# EAGLE design Relay_Board_V3 (EAGLE 8.4.0)

## Sheet 1 of 2
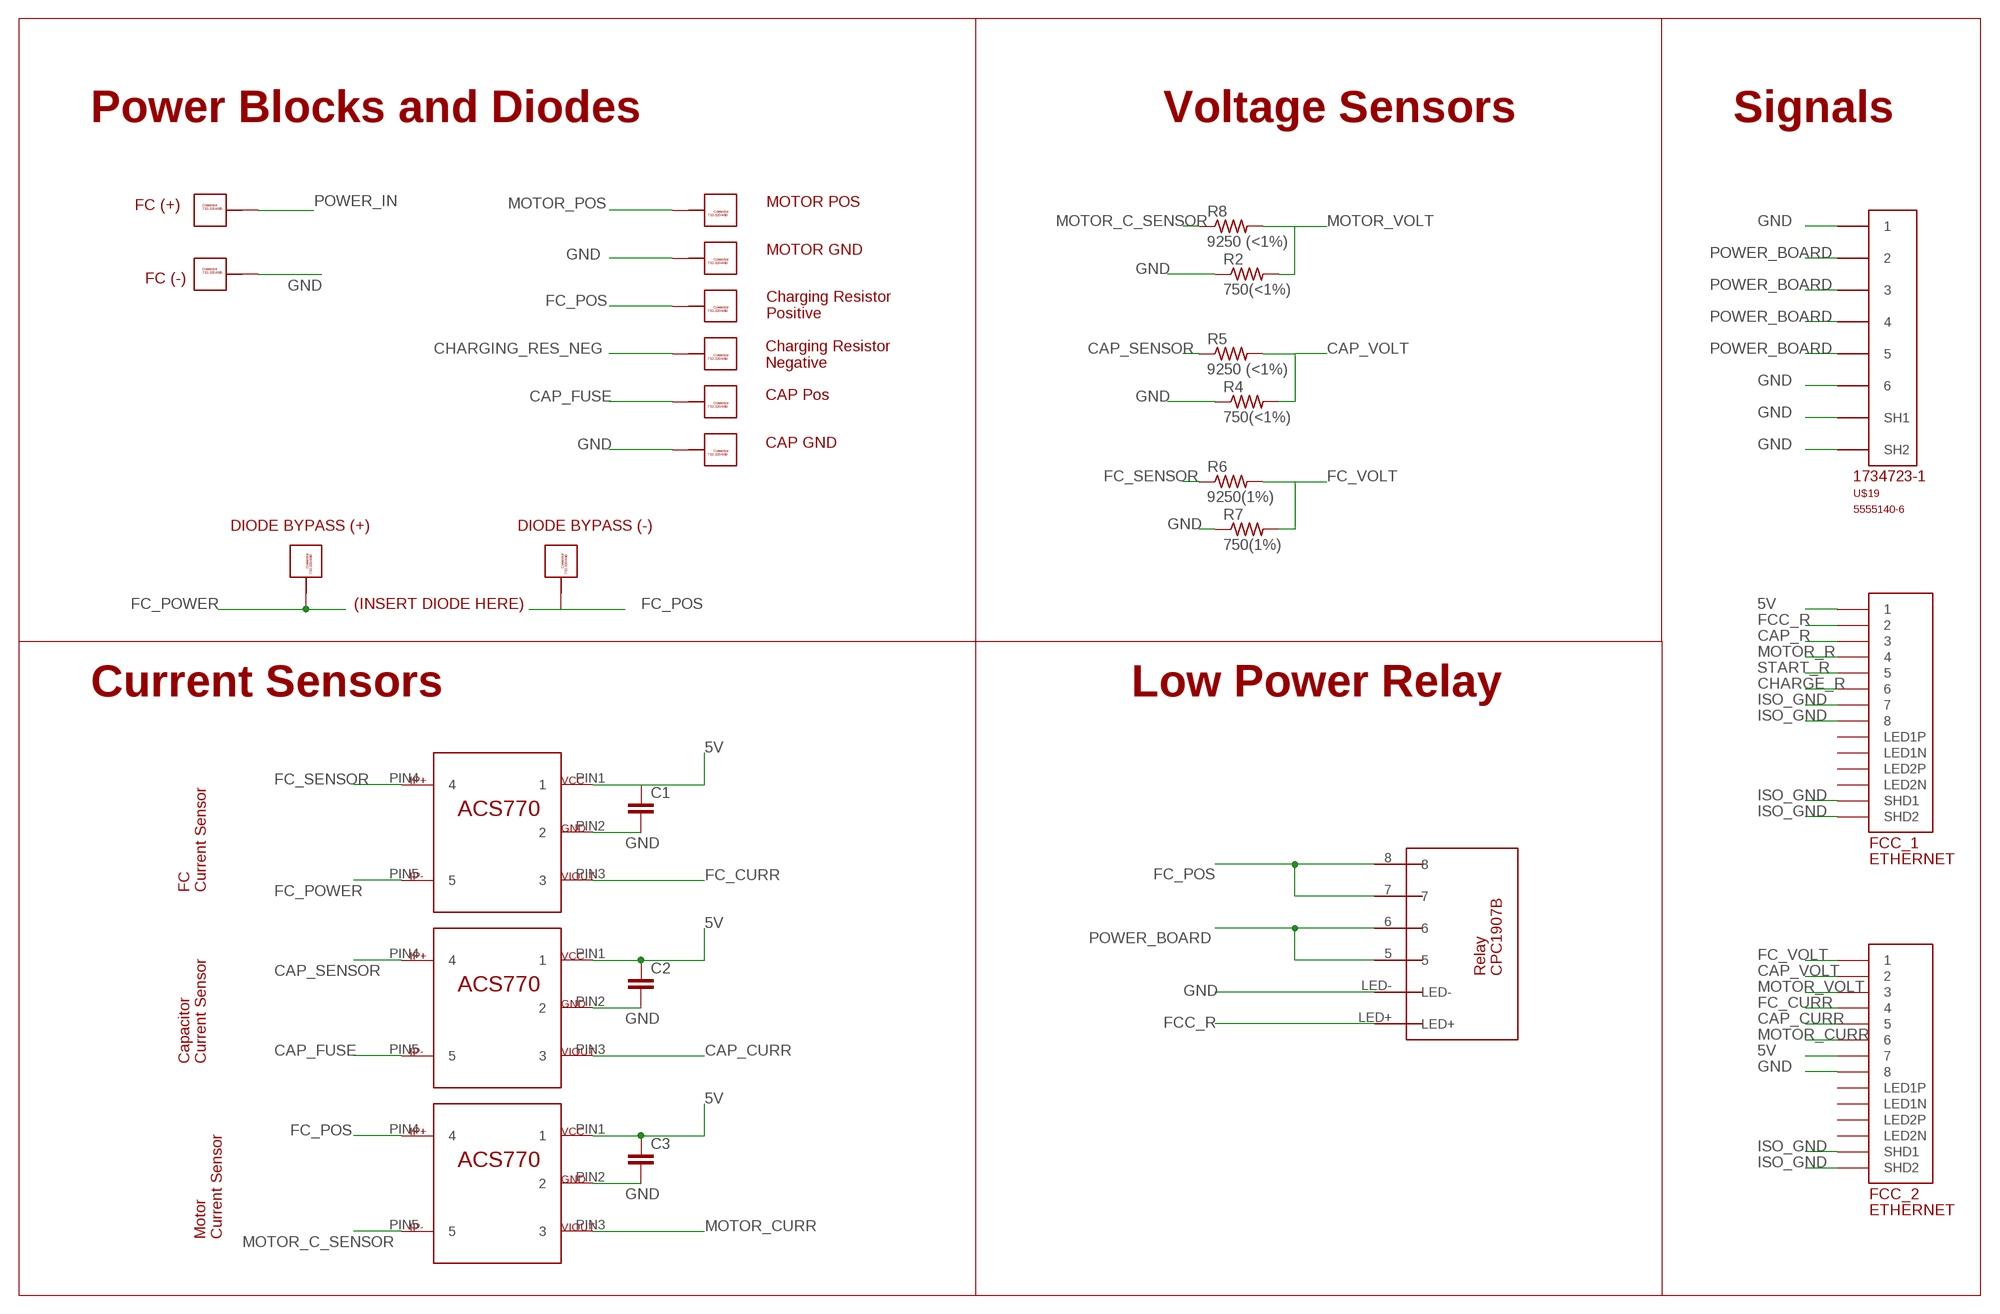
[diagram p0: schematic, sheet 1]

### Parts
C1  CAP0603-CAP  [0603-CAP]
C2  CAP0603-CAP  [0603-CAP]
C3  CAP0603-CAP  [0603-CAP]
CAP.GND  732-3204-ND_CONNECTOR  [732-3204-ND]
CAP.GND1  732-3204-ND_CONNECTOR  [732-3204-ND]
CAP.POS1  732-3204-ND_CONNECTOR  [732-3204-ND]
CAP.POS2  732-3204-ND_CONNECTOR  [732-3204-ND]
FC.GND  732-3204-ND_CONNECTOR  [732-3204-ND]
FC.POS  732-3204-ND_CONNECTOR  [732-3204-ND]
FCC_1  ETHERNET  [A122645-ND]
FCC_2  ETHERNET  [A122645-ND]
MOTOR.GROUND  732-3204-ND_CONNECTOR  [732-3204-ND]
MOTOR.POSITIVE  732-3204-ND_CONNECTOR  [732-3204-ND]
R2  750(<1%)  R-US_R0805  [R0805]
R4  750(<1%)  R-US_R0805  [R0805]
R5  9250 (<1%)  R-US_R0805  [R0805]
R6  9250(1%)  R-US_R0805  [R0805]
R7  750(1%)  R-US_R0805  [R0805]
R8  9250 (<1%)  R-US_R0805  [R0805]
RES.NEG  732-3204-ND_CONNECTOR  [732-3204-ND]
RES.POS  732-3204-ND_CONNECTOR  [732-3204-ND]
U$7  ACS770LCB_CURRENTSENSOR  [ACS770LCB_CURRENTSENSOR]
U$8  ACS770LCB_CURRENTSENSOR  [ACS770LCB_CURRENTSENSOR]
U$9  ACS770LCB_CURRENTSENSOR  [ACS770LCB_CURRENTSENSOR]
U$19  5555140-6  [1734723-1_RJ11]
U$22  RELAY-CPC1907B  [RELAY-CPC1907B]

### Nets
5V: C1.1 C2.1 C3.1 FCC_1.P$1 FCC_2.P$7 U$7.PIN1 U$8.PIN1 U$9.PIN1
CAP_CURR: FCC_2.P$5 U$8.PIN3
CAP_FUSE: CAP.GND1.P$1 CAP.GND1.P$2 CAP.GND1.P$3 CAP.GND1.P$4 CAP.GND1.P$5 CAP.GND1.P$6 CAP.GND1.P$7 CAP.GND1.P$8 CAP.GND1.P$9 CAP.GND1.P$10 U$8.PIN5 ; also sheet 2
CAP_R: FCC_1.P$3 ; also sheet 2
CAP_SENSOR: R5.1 U$8.PIN4
CAP_VOLT: FCC_2.P$2 R4.2 R5.2
CHARGE_R: FCC_1.P$6 ; also sheet 2
CHARGING_RES_NEG: RES.NEG.P$1 RES.NEG.P$2 RES.NEG.P$3 RES.NEG.P$4 RES.NEG.P$5 RES.NEG.P$6 RES.NEG.P$7 RES.NEG.P$8 RES.NEG.P$9 RES.NEG.P$10 ; also sheet 2
FC_CURR: FCC_2.P$4 U$7.PIN3
FC_POS: CAP.POS2.P$1 CAP.POS2.P$2 CAP.POS2.P$3 CAP.POS2.P$4 CAP.POS2.P$5 CAP.POS2.P$6 CAP.POS2.P$7 CAP.POS2.P$8 CAP.POS2.P$9 CAP.POS2.P$10 RES.POS.P$1 RES.POS.P$2 RES.POS.P$3 RES.POS.P$4 RES.POS.P$5 RES.POS.P$6 RES.POS.P$7 RES.POS.P$8 RES.POS.P$9 RES.POS.P$10 U$9.PIN4 U$22.7 U$22.8 ; also sheet 2
FC_POWER: CAP.POS1.P$1 CAP.POS1.P$2 CAP.POS1.P$3 CAP.POS1.P$4 CAP.POS1.P$5 CAP.POS1.P$6 CAP.POS1.P$7 CAP.POS1.P$8 CAP.POS1.P$9 CAP.POS1.P$10 U$7.PIN5
FC_SENSOR: R6.1 U$7.PIN4
FC_VOLT: FCC_2.P$1 R6.2 R7.2
FCC_R: FCC_1.P$2 U$22.LED+
GND: C1.2 C2.2 C3.2 CAP.GND.P$1 CAP.GND.P$2 CAP.GND.P$3 CAP.GND.P$4 CAP.GND.P$5 CAP.GND.P$6 CAP.GND.P$7 CAP.GND.P$8 CAP.GND.P$9 CAP.GND.P$10 FC.GND.P$1 FC.GND.P$2 FC.GND.P$3 FC.GND.P$4 FC.GND.P$5 FC.GND.P$6 FC.GND.P$7 FC.GND.P$8 FC.GND.P$9 FC.GND.P$10 FCC_2.P$8 MOTOR.GROUND.P$1 MOTOR.GROUND.P$2 MOTOR.GROUND.P$3 MOTOR.GROUND.P$4 MOTOR.GROUND.P$5 MOTOR.GROUND.P$6 MOTOR.GROUND.P$7 MOTOR.GROUND.P$8 MOTOR.GROUND.P$9 MOTOR.GROUND.P$10 R2.1 R4.1 R7.1 U$7.PIN2 U$8.PIN2 U$9.PIN2 U$19.1 U$19.6 U$19.SH1 U$19.SH2 U$22.LED- ; also sheet 2
ISO_GND: FCC_1.P$7 FCC_1.P$8 FCC_1.P$13(SHD1) FCC_1.P$14(SHD2) FCC_2.P$13(SHD1) FCC_2.P$14(SHD2) ; also sheet 2
MOTOR_C_SENSOR: R8.1 U$9.PIN5 ; also sheet 2
MOTOR_CURR: FCC_2.P$6 U$9.PIN3
MOTOR_POS: MOTOR.POSITIVE.P$1 MOTOR.POSITIVE.P$2 MOTOR.POSITIVE.P$3 MOTOR.POSITIVE.P$4 MOTOR.POSITIVE.P$5 MOTOR.POSITIVE.P$6 MOTOR.POSITIVE.P$7 MOTOR.POSITIVE.P$8 MOTOR.POSITIVE.P$9 MOTOR.POSITIVE.P$10 ; also sheet 2
MOTOR_R: FCC_1.P$4 ; also sheet 2
MOTOR_VOLT: FCC_2.P$3 R2.2 R8.2
POWER_BOARD: U$19.2 U$19.3 U$19.4 U$19.5 U$22.5 U$22.6
POWER_IN: FC.POS.P$1 FC.POS.P$2 FC.POS.P$3 FC.POS.P$4 FC.POS.P$5 FC.POS.P$6 FC.POS.P$7 FC.POS.P$8 FC.POS.P$9 FC.POS.P$10
START_R: FCC_1.P$5 ; also sheet 2
Unconnected: FCC_1.P$9(LED1N) FCC_1.P$10(LED1P) FCC_1.P$11(LED2N) FCC_1.P$12(LED2P) FCC_2.P$9(LED1N) FCC_2.P$10(LED1P) FCC_2.P$11(LED2N) FCC_2.P$12(LED2P)

### Notes on the sheet
- Power Blocks and Diodes | Voltage Sensors | Signals
- FC (+) | MOTOR POS
- MOTOR GND
- FC (-)
- Charging Resistor
  Positive
- Charging Resistor
  Negative
- CAP Pos
- CAP GND
- DIODE BYPASS (+) | DIODE BYPASS (-)
- (INSERT DIODE HERE)
- Current Sensors | Low Power Relay
- FC
  Current Sensor
- Capacitor
  Current Sensor
- Motor
  Current Sensor

## Sheet 2 of 2
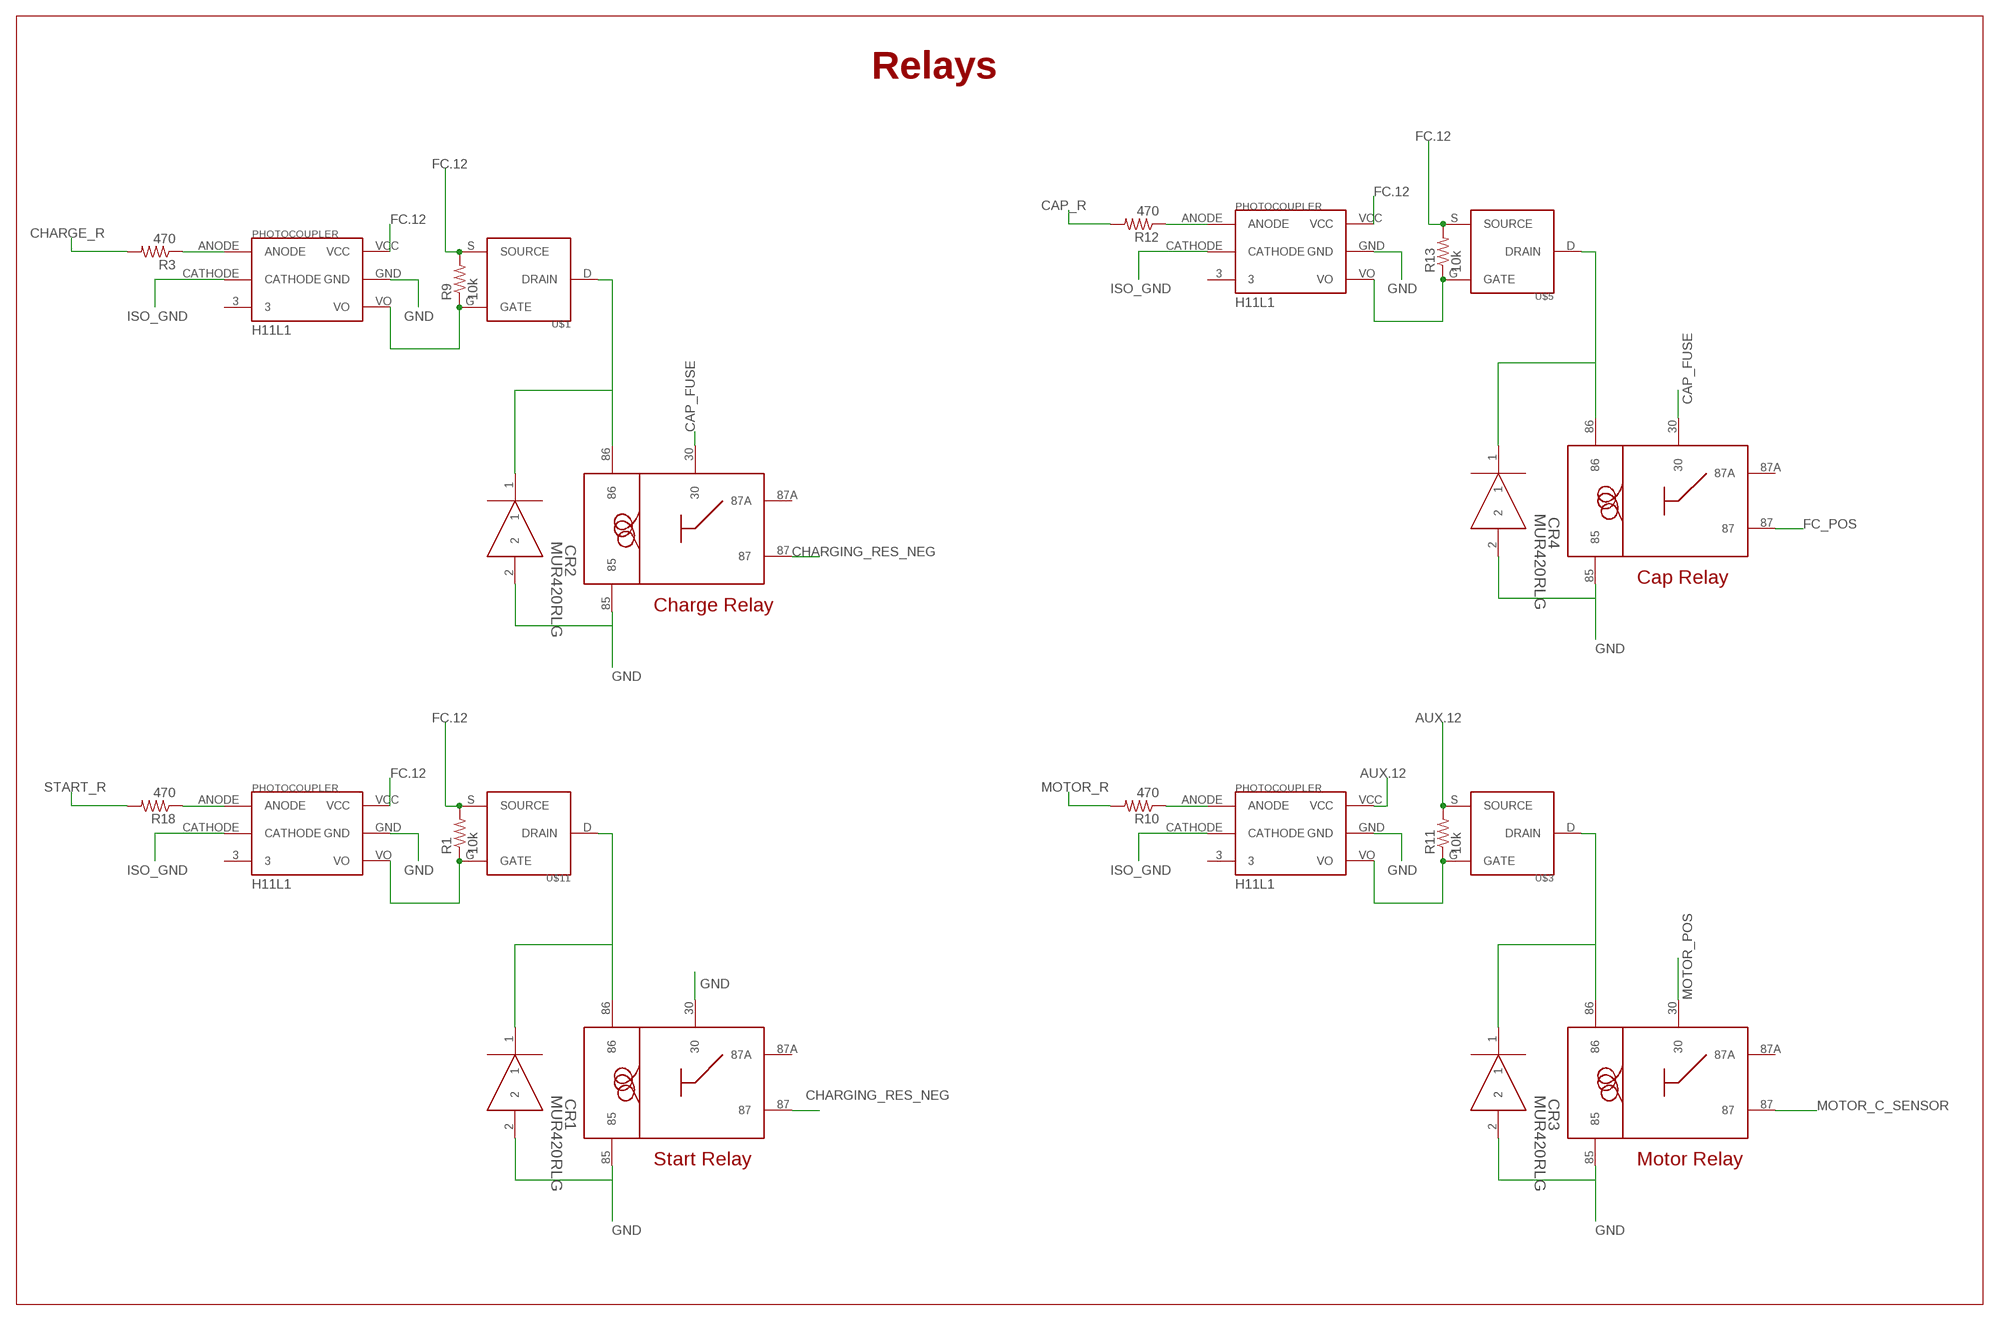
[diagram p1: schematic, sheet 2]

### Parts
CR1  MUR420RLG  [DO-201AD]
CR2  MUR420RLG  [DO-201AD]
CR3  MUR420RLG  [DO-201AD]
CR4  MUR420RLG  [DO-201AD]
R1  10k  RESISTOR0603-RES  [0603-RES]
R3  470  RESISTOR0603-RES  [0603-RES]
R9  10k  RESISTOR0603-RES  [0603-RES]
R10  470  RESISTOR0603-RES  [0603-RES]
R11  10k  RESISTOR0603-RES  [0603-RES]
R12  470  RESISTOR0603-RES  [0603-RES]
R13  10k  RESISTOR0603-RES  [0603-RES]
R18  470  RESISTOR0603-RES  [0603-RES]
START.RELAY1  VCF4-1000  [VCF4-1000]
START.RELAY2  VCF4-1000  [VCF4-1000]
START.RELAY3  VCF4-1000  [VCF4-1000]
START.RELAY4  VCF4-1000  [VCF4-1000]
U$1  DMP3056L-7DMP3056L-7  [DMP3056L-7]
U$2  H11L1H11L1  [H11L1]
U$3  DMP3056L-7DMP3056L-7  [DMP3056L-7]
U$4  H11L1H11L1  [H11L1]
U$5  DMP3056L-7DMP3056L-7  [DMP3056L-7]
U$6  H11L1H11L1  [H11L1]
U$11  DMP3056L-7DMP3056L-7  [DMP3056L-7]
U$12  H11L1H11L1  [H11L1]

### Nets
AUX.12: R11.2 U$3.S(SOURCE) U$4.VCC
CAP_FUSE: START.RELAY2.30 START.RELAY4.30 ; also sheet 1
CAP_R: R12.2 ; also sheet 1
CHARGE_R: R3.2 ; also sheet 1
CHARGING_RES_NEG: START.RELAY1.87 START.RELAY2.87 ; also sheet 1
FC.12: R1.2 R9.2 R13.2 U$1.S(SOURCE) U$2.VCC U$5.S(SOURCE) U$6.VCC U$11.S(SOURCE) U$12.VCC
FC_POS: START.RELAY4.87 ; also sheet 1
GND: CR1.2 CR2.2 CR3.2 CR4.2 START.RELAY1.30 START.RELAY1.85 START.RELAY2.85 START.RELAY3.85 START.RELAY4.85 U$2.GND U$4.GND U$6.GND U$12.GND ; also sheet 1
ISO_GND: U$2.CATHODE U$4.CATHODE U$6.CATHODE U$12.CATHODE ; also sheet 1
MOTOR_C_SENSOR: START.RELAY3.87 ; also sheet 1
MOTOR_POS: START.RELAY3.30 ; also sheet 1
MOTOR_R: R10.2 ; also sheet 1
N$1: R9.1 U$1.G(GATE) U$2.VO
N$2: R3.1 U$2.ANODE
N$3: CR2.1 START.RELAY2.86 U$1.D(DRAIN)
N$4: R11.1 U$3.G(GATE) U$4.VO
N$5: R10.1 U$4.ANODE
N$6: CR3.1 START.RELAY3.86 U$3.D(DRAIN)
N$7: R13.1 U$5.G(GATE) U$6.VO
N$8: R12.1 U$6.ANODE
N$13: CR4.1 START.RELAY4.86 U$5.D(DRAIN)
N$21: R1.1 U$11.G(GATE) U$12.VO
N$23: R18.1 U$12.ANODE
N$30: CR1.1 START.RELAY1.86 U$11.D(DRAIN)
START_R: R18.2 ; also sheet 1
Unconnected: START.RELAY1.87A START.RELAY2.87A START.RELAY3.87A START.RELAY4.87A U$2.3 U$4.3 U$6.3 U$12.3

### Notes on the sheet
- Relays
- Cap Relay
- Charge Relay
- Start Relay | Motor Relay

## Library data of the parts
C1-C3 = SparkFun-Passives:CAP: Capacitor Standard 0603 ceramic capacitor, and 0.1" leaded capacitor.
CAP.GND CAP.GND1 CAP.POS1 CAP.POS2 FC.GND FC.POS MOTOR.GROUND MOTOR.POSITIVE RES.NEG RES.POS = Connector 732-3204:732-3204-ND_CONNECTOR
CR1-CR4 = MUR420RLG - Diode:MUR420RLG; MANUFACTURER_PART_NUMBER: MUR420RLG; VENDOR: ON Semiconductor
FCC_1 FCC_2 = ETHERNET-3:ETHERNET: Ethernet port with 2 leds. digikey number A122645-ND
R1 R3 R9-R13 R18 = SparkFun:RESISTOR: Resistor Basic schematic elements and footprints for 0603, 1206, and PTH resistors.
R2 R4-R8 = resistor:R-US_: RESISTOR, American symbol
START.RELAY1-START.RELAY4 = VCF4-1000:VCF4-1000: Part for the VCF4-1000 relay socket. Digi-Key Part Number: PB232-ND. Pin numbering is directly taken from the data sheet of the relay. Relay Digi-Key Part Number: 255-2083-ND (Also works with 255-1825-ND). If using relay 255-1825-ND, ignore pin 87A.
U$1 U$3 U$5 U$11 = DMP3056L-7:DMP3056L-7
U$2 U$4 U$6 U$12 = FCC_parts:H11L1
U$7-U$9 = ACS770 Current Sensor:ACS770LCB_CURRENTSENSOR
U$19 = 5555140-6 RJ11:5555140-6
U$22 = Relay_CPC1907B:RELAY-CPC1907B

## Board
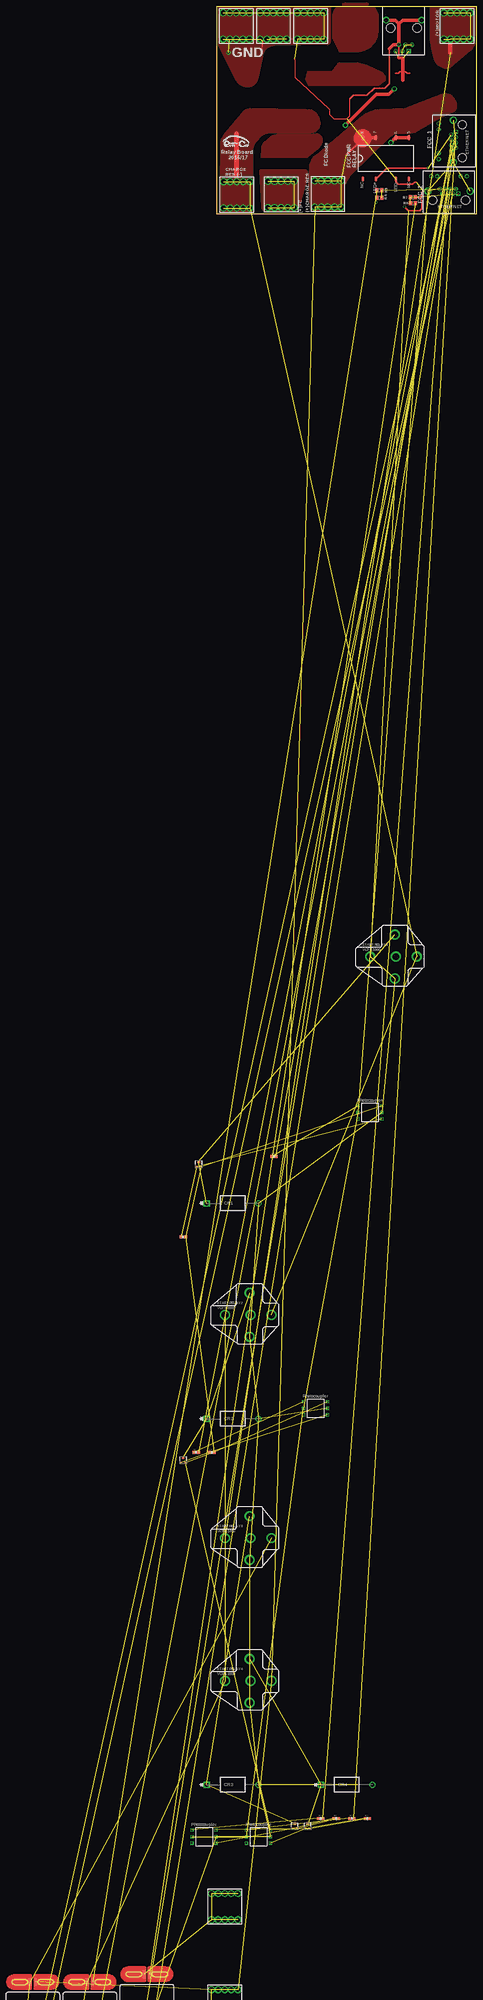
[diagram p2: board, top side]
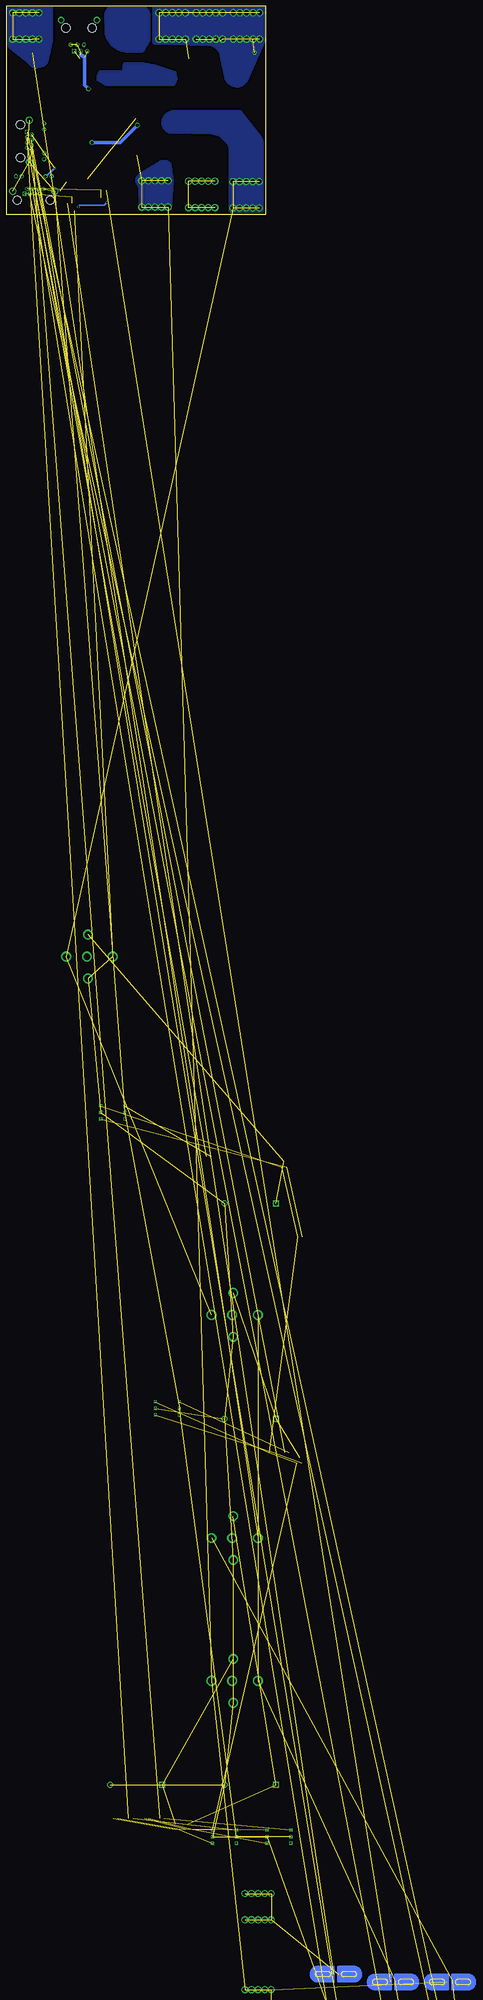
[diagram p3: board, bottom side, seen from below]

Size 100 x 80 mm. Coordinates in mm from the lower left corner, seen from the top.
Outline: 0,0 0,80 100,80 100,0 0,0
Copper layers (1*16): Top 0.035mm / dielectric 1.5mm / Bottom 0.035mm
Design rules "SeeedStudio_2layer_DRU_no_angle_20140221": minimum track width 6mil, minimum drill 12mil, track to track 6mil, track to pad 6mil, pad to pad 6mil, via to via 6mil, smd to smd 0mil, copper to edge 10mil, drill to drill 10mil, minimum pad ring 10mil, minimum via ring 6mil, stop-mask expansion 2mil, vias tented up to drill 100mil, thermal gap 10mil

### Footprints (pad centres in the part's own frame; a part is rotated, then mirrored left to right if it is on the bottom)
0603-CAP = smd 1.1 x 1: 1 -0.85,0; 2 0.85,0
732-3204-ND = drill 1.76: P$1 -5.08,5.08; P$2 -2.54,5.08; P$3 0,5.08; P$4 2.54,5.08; P$5 5.08,5.08; P$6 5.08,-5.08; P$7 2.54,-5.08; P$8 0,-5.08; P$9 -2.54,-5.08; P$10 -5.08,-5.08
DO-201AD = drill 1.549 pad 2.057 square: 1 -19.914,0 | drill 1.549 pad 2.057: 2 0,0
A122645-ND = drill 1 square: P$1 3.58,2.54 | drill 1: P$2 2.56,4.32; P$3 1.54,2.54; P$4 0.52,4.32; P$5 -0.5,2.54; P$6 -1.52,4.32; P$7 -2.54,2.54; P$8 -3.56,4.32; P$9 -6.86,9.14; P$10 -4.57,9.14; P$11 4.57,9.14; P$12 6.86,9.14 | drill 1.8: P$13 -8.13,3.43; P$14 8.13,3.43 | hole 3.25: -6.35,0; 6.35,0
0603-RES = smd 1.1 x 1: 1 -0.85,0; 2 0.85,0
R0805 = smd 1.3 x 1.5: 1 -0.95,0; 2 0.95,0
VCF4-1000 = drill 2.57 pad 3.81: 30 -17.9,0; 85 -8.407,-8.445; 86 -8.407,8.445; 87 0,0; 87A -8,0
DMP3056L-7 = smd 0.8 x 0.9: D 0,1; G -0.95,-1; S 0.95,-1
H11L1 = drill 0.6 square: 3 -4.635,-2.54; ANODE -4.635,2.54; CATHODE -4.635,0; GND 4.635,0; VCC 4.635,2.54; VO 4.635,-2.54
ACS770LCB_CURRENTSENSOR = drill 0.9: PIN1 -1.91,-21.4; PIN2 0,-21.4; PIN3 1.91,-21.4 | smd 1 x 3: PIN4 1,0; PIN5 -1,0
1734723-1_RJ11 = drill 1 square: 1 -2.54,2.54 | drill 1: 2 0,2.54; 3 2.54,2.54; 4 -3.81,0; 5 -1.27,0; 6 1.27,0 | drill 1.65: SH1 -7.5,-9.4; SH2 6.22,-9.4 | hole 3.3: -5.72,-6.35; 4.44,-6.35
RELAY-CPC1907B = smd 2 x 0.95: 5 7.95,-8.891; 6 7.95,-3.809; 7 7.95,3.811; 8 7.95,8.891; LED+ -7.95,3.811; LED- -7.95,-3.811; NC_1 -7.95,8.891; NC_2 -7.95,-8.891

### Placement (x,y rotation side)
C1  -34,-709 0 top  (outside the outline)
C2  -78,-712 0 top  (outside the outline)
C3  -78,-715 0 top  (outside the outline)
CAP.GND  21.78,72.5 0 top
CAP.GND1  -63,-735 0 top  (outside the outline)
CAP.POS1  3,-652 0 top  (outside the outline)
CAP.POS2  3,-689 0 top  (outside the outline)
CR1  16,-381 0 top  (outside the outline)
CR2  16,-464 0 top  (outside the outline)
CR3  16,-605 0 top  (outside the outline)
CR4  60,-605 0 top  (outside the outline)
FC.GND  7.47,72.5 0 top
FC.POS  24.74,7.62 0 top
FCC_1  94.63,28.07 90 top
FCC_2  89.48,5.4 0 top
MOTOR.GROUND  36.09,72.5 0 top
MOTOR.POSITIVE  92.55,72.49 0 top
R1  -13,-394 0 top  (outside the outline)
R2  -79,-764 0 top  (outside the outline)
R3  -8,-477 0 top  (outside the outline)
R4  62.62,6.33 0 top
R5  62.62,9.24 0 top
R6  75.55,4.15 180 top
R7  75.55,6.49 180 top
R8  -79,-757 0 top  (outside the outline)
R9  -2,-477 0 top  (outside the outline)
R10  40,-618 0 top  (outside the outline)
R11  46,-618 0 top  (outside the outline)
R12  52,-618 0 top  (outside the outline)
R13  58,-618 0 top  (outside the outline)
R18  22,-363 0 top  (outside the outline)
RES.NEG  7.62,7.47 0 top
RES.POS  42.78,7.78 0 top
START.RELAY1  77,-286 0 top  (outside the outline)
START.RELAY2  21,-424 0 top  (outside the outline)
START.RELAY3  21,-510 0 top  (outside the outline)
START.RELAY4  21,-565 0 top  (outside the outline)
U$1  -13,-480 0 top  (outside the outline)
U$2  38,-460 0 top  (outside the outline)
U$3  30,-621 0 top  (outside the outline)
U$4  -5,-625 0 top  (outside the outline)
U$5  35,-621 0 top  (outside the outline)
U$6  16,-625 0 top  (outside the outline)
U$7  -27,-678 0 top  (outside the outline)
U$8  -49,-681 0 top  (outside the outline)
U$9  -71,-681 0 top  (outside the outline)
U$11  -7,-366 0 top  (outside the outline)
U$12  59,-346 0 top  (outside the outline)
U$16  [LOGO]  7.78,27.71 0 top
U$19  71.41,65.34 180 top
U$22  65.09,21.48 90 top

### Tracks (layer width: path | path; a pad name or v marks a point on that pad's centre or on a via)
5V  (7 unrouted)
AUX.12  (2 unrouted)
CAP_CURR  (1 unrouted)
CAP_FUSE  (12 unrouted)
  pour Bottom (no thermals): 46.99,58.42 42.57,57.58 34.95,55.04 34.29,52.07 35.56,49.53 61.59,49.53 64.77,51.44 64.77,53.34 64.14,55.24 55.24,55.24 54.61,58.42
  pour Top (no thermals): 54.46,58.34 57.56,57.48 63.3,54.86 64.77,53.34 64.77,51.44 62.23,49.53 35.56,49.53 34.29,52.07 35.03,55.07 44.55,55.07 47.07,58.32
CAP_R  (1 unrouted)
CAP_SENSOR  (1 unrouted)
CAP_VOLT  (2 unrouted)
CHARGE_R  (1 unrouted)
CHARGING_RES_NEG  (11 unrouted)
  Top 1.676: 7.62,31.12 RES.NEG.P$3
  pour Top (no thermals): 13.69,13.69 13.69,1.4 1.56,1.24 1.56,13.54
  pour Top (isolate 0.305, rank 2, no thermals): 39.28,37.29 arc61 36.26,40.08 34.24,40.27 13.03,40.57 arc52 9.6,38.96 2.42,30.14 arc39 1.39,27.27 1.27,10.16 13.97,8.26 13.9,24.15 arc-42 15.57,28.5 16.83,29.89 arc-48 20.09,31.35 36.12,31.41 arc92 39.98,35.48
  pour Bottom (no thermals): 39.58,35.37 arc78 36.2,39.38 10.82,39.44 arc52 9.8,39.28 2.79,30.48 arc39 1.55,26.95 1.55,1.4 13.68,1.24 13.71,25.38 arc-42 14.45,27.27 16.29,29.29 arc-46 20.68,31.29 35.83,31.7 arc101
FC.12  (8 unrouted)
FC_CURR  (1 unrouted)
FC_POS  (22 unrouted)
  Top 0.61: 56.2,29.13 49.78,22.71
  Top 1.27: U$22.7 U$22.8
  Top 7: U$22.8 56.2,29.13
  pour Top (rank 4, no thermals): 48.9,10.16 49.11,2.87 arc-92 47.54,1.24 37.5,1.24 arc-87 36.01,2.65 35.56,10.79 35.56,14.61 35.76,17.42 arc-48 37.62,22.07 39.27,23.35 43.72,27.19 56.24,37.65 arc-37 62.72,40.18 72.39,40.64 86.91,46.12 arc-81 91.14,44.58 92.01,43.03 arc-93 90.89,39.41 84.45,36.2 77.66,32.31 arc-30 73.15,31.11 69.89,31.11 arc44 66.54,29.76 51.44,15.24 48.6,10.12
  pour Bottom (no thermals): 36.61,1.71 47.31,1.64 arc89 48.73,3.01 48.9,10.16 49.82,11.98 arc60 49.7,14.16 arc26 47.49,16.26 40.51,20.33 arc112 36.56,18.42 35.74,12.75
FC_POWER  (10 unrouted)
  pour Top (isolate 0.305, rank 3, no thermals): 16.93,22 34.21,21.87 arc40 35.14,22.2 39.28,25.56 arc49 40.7,28.43 arc91 38.43,30.81 35.74,30.86 22.92,30.52 arc40 20.59,29.6 18.17,27.49 arc46 17.1,25.3
FC_SENSOR  (1 unrouted)
FC_VOLT  (2 unrouted)
FCC_R  (via drill 0.6)  (1 unrouted)
  Top 0.61: U$22.LED+ 65.48,17.72 v81.43,17.8
  Bottom 0.61: v81.43,17.8 84.71,14.54
GND  (via drill 0.6, 1)  (55 unrouted)
  Top 0.406: MOTOR.GROUND.P$10 20.3,67.42 17.6,66.62 16.96,61.65 | 71.67,51.51 71.69,51.55 | 61.47,6.12 R4.1 61.35,6.2 | R7.1 78.51,6.51 | v72.31,2.87 72.04,2.82 | 51.34,44.49 51.34,37.99 50.18,36.83 45.09,36.83 43.41,38.51 43.41,40.45 30.34,52.58 30.34,59.32 29.84,59.82 29.9,59.82 | 70.16,65.34 U$19.6 | 71.49,60.13 71.69,60.13 71.72,60.1 | 65.19,74.68 U$19.SH2 | 78.53,1.63
  Top 0.508: 68.83,54.27 69.98,54.27 | 74.46,54.27 73.32,54.27 72.7,54.9 71.69,54.9 | 51.34,44.49 52.58,45.74 57.89,45.74 60.68,48.46 64.72,48.48 66.55,50.29 66.55,58.32
  Top 0.61: 69.98,54.27 70.6,54.9 71.69,54.9 | 78.51,6.51 79,5.03 79,2.1 78.53,1.63 78.22,1.32 73.87,1.32 v72.31,2.87 | R7.1 78.51,6.46 79,7.15 79,8.32 79.54,8.86 81.47,8.86 | U$22.LED- 68.9,12.59 69.98,11.51 75.34,11.51 76.2,12.36 76.96,12.36 | 61.35,6.2 v61.35,4.51 | 70.14,60.22 U$19.6 | 66.55,58.32 66.52,63.63
  Top 1.27: 71.69,51.55 71.69,54.9 71.69,60.13 | 70.14,60.22 71.49,60.13 | 66.52,63.63 68,65.34 U$19.6 | 70.16,65.34 70.16,73.28 | 70.16,73.28 68.76,74.68 65.19,74.68 | U$19.SH1 71.65,74.75 70.16,73.28
  Bottom 0.61: v72.31,2.87 71.73,3.45 69.27,3.42 67.42,3.42 62.44,3.42 v61.35,4.51
  other vias: 4.45,62.23
  pour Top (no thermals): 43.21,66.43 arc-86 42.64,65.87 21.97,65.39 arc77 17.15,61.01 15.19,51.96 arc-77 12.1,49.53 11.68,49.53 arc-64 7.65,52.03 0.13,67.23 -1.77,81.11 43.35,80.7 43.35,66.66
  pour Bottom (no thermals): 43.05,65.96 43.05,82.38 -0.89,80.47 -2.79,68.34 arc-131 0.16,68.29 7.62,51.44 8.69,50.36 arc45 10.7,49.53 11.13,49.53 arc63 15.24,52.07 17.03,61.02 arc-77 22.36,65.49
ISO_GND  (9 unrouted)
MOTOR_C_SENSOR  (2 unrouted)
MOTOR_CURR  (1 unrouted)
MOTOR_POS  (10 unrouted)
  Top 1.676: 90.01,62.21 MOTOR.POSITIVE.P$9
  pour Top (no thermals): 99.41,79.19 99.41,67.77 arc-53 97.2,63.29 89.62,56.86 arc-48 87.79,56.75 arc-74 84.04,60.71 83.23,64.03 arc-13 82.66,68.63 82.61,79.3
  pour Bottom (no thermals): 91.64,58.81 98.13,64.01 arc50 99.36,66.52 99.56,78.87 82.78,79.77 82.78,67.01 84.54,59.14 arc77 86.09,57.41 88.33,56.7 arc48
MOTOR_R  (1 unrouted)
MOTOR_VOLT  (2 unrouted)
N$1  (2 unrouted)
N$2  (1 unrouted)
N$3  (2 unrouted)
N$4  (2 unrouted)
N$5  (1 unrouted)
N$6  (2 unrouted)
N$7  (2 unrouted)
N$8  (1 unrouted)
N$13  (2 unrouted)
N$21  (2 unrouted)
N$23  (1 unrouted)
N$30  (2 unrouted)
POWER_BOARD  (via drill 1.2)  (4 unrouted)
  Top 1.27: U$22.5 U$22.6 68.8,29.4 v67.03,27.56 | v49.53,34.29 52.33,37.08 61.45,46.21 66.33,46.21 67.18,47.08 v68.38,48.26
  Bottom 1.27: v49.53,34.29 56.23,27.56 v67.03,27.56 | v68.38,48.26 69.77,49.69 69.8,60.51 71.41,61.48
POWER_IN  (9 unrouted)
  pour Top (no thermals): 34.34,13.94 31.19,2.9 arc-73 29.41,1.54 19.09,1.41 arc-88 17.81,2.61 17.07,16.81 34.41,16.59
START_R  (1 unrouted)
SUPERCAP.POS
  pour Top (no thermals): 45.09,67.94 45.12,76.02 arc-89 49.96,80.86 56.87,80.89 arc-91 61.64,76.08 61.58,70.25 arc-71 56.75,63.59 54.61,62.87 52.07,62.87 47.77,62.81 arc-64 47.68,62.86
  pour Bottom (no thermals): 45.19,67.18 45.19,76.3 arc-91 49.32,80.37 58.43,80.23 arc-90 61.54,76.34 61.43,70.83 arc-74 56.37,63.52 53.98,62.87 47.62,62.87

### Text on the board
tNames: (+)MOTOR | GND | Relay Board / 2016/17 | FC Diode | FCC PWR / RELAY | CHARGE / RES (-) | (+)CHARGE.RES | (+)FC
tValues: (+)CAP
bValues: GND | GND | GND | (+)MOTOR | CAP + | GND | CHARGE / RES (-) | (+)FC | (+)CHARGE.RES